# Altium schematic sheet RADIO.SchDoc
size A4
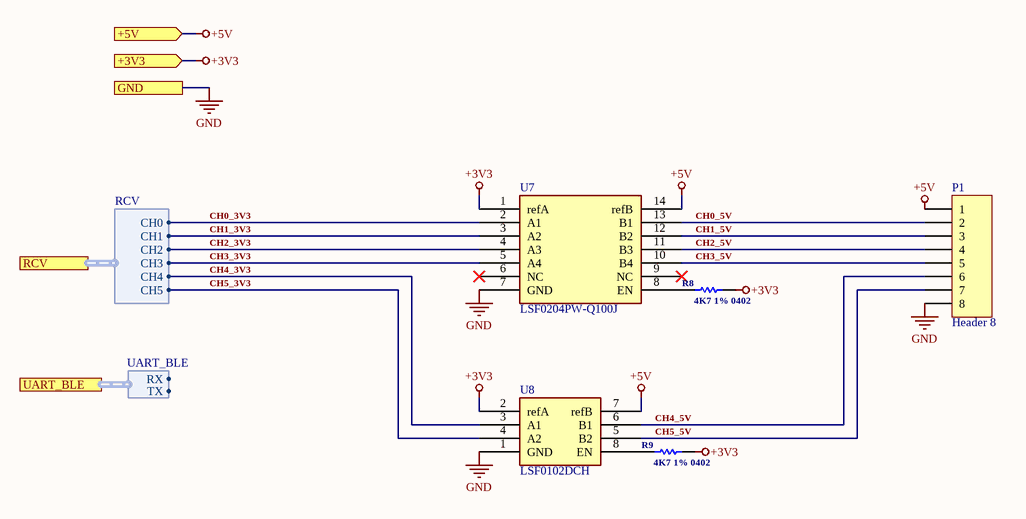
[diagram p0: RADIO.SchDoc]

## Parts
P1  Header 8  [HDR1X8]
R8  4K7 1% 0402  [Resistor_0402]
R9  4K7 1% 0402  [Resistor_0402]
U7  LSF0204PW-Q100J  [TSOP65P640X110-14N]
U8  LSF0102DCH

## Ports
+3V3 (in), +5V (in), GND, RCV (harness RCV), UART_BLE (harness UART_BLE)

## Harnesses
RCV: CH0, CH1, CH2, CH3, CH4, CH5
UART_BLE: RX, TX

## Nets
+3V3: R8.2 R9.2 U7.1(refA) U8.2(refA) ; port +3V3
+5V: P1.1 U7.14(refB) U8.7(refB) ; port +5V
GND: P1.8 U7.7(GND) U8.1(GND) ; port GND
CH0_3V3: U7.2(A1) ; port RCV.CH0
CH0_5V: P1.2 U7.13(B1)
CH1_3V3: U7.3(A2) ; port RCV.CH1
CH1_5V: P1.3 U7.12(B2)
CH2_3V3: U7.4(A3) ; port RCV.CH2
CH2_5V: P1.4 U7.11(B3)
CH3_3V3: U7.5(A4) ; port RCV.CH3
CH3_5V: P1.5 U7.10(B4)
CH4_3V3: U8.3(A1) ; port RCV.CH4
CH4_5V: P1.6 U8.6(B1)
CH5_3V3: U8.4(A2) ; port RCV.CH5
CH5_5V: P1.7 U8.5(B2)
NetR8_1: R8.1 U7.8(EN)
NetR9_1: R9.1 U8.8(EN)

Not connected (* = marked no-connect by the designer): U7 6(NC)* 9(NC)*

## Library data of the parts
P1 = Header 8: Header, 8-Pin; LatestRevisionDate: 17-Jul-2002; LatestRevisionNote: Re-released for DXP Platform.; Publisher: Altium Limited
R8 R9 = AC0402FR-074K7L 4.7K 1% 0402: Thick Film Resistors 1/16W 4.7K ohm 1% AEC-Q200; Manufacturer: Yageo; Resistance: 4.7 kOhms; Power Rating: 62.5 mW (1/16 W); Temperature Coefficient: 100 PPM / C; Voltage Rating: 50 V; Unit Weight: 0.000023 oz; Supplier 1: Digi-Key; Manufacturer Part Number: AC0402FR-074K7L; Stock 1: 3; Pricing 1: 1=0.1, 10=0.021, 100=0.0086, 1000=0.0039, 2500=0.0033, 5000=0.0028 (USD); Product Category: Thick Film Resistors; RoHS: True; Tolerance: 1 %; Case Code - in: 0402; Case Code - mm: 1005; Operating Temperature Range: - 55 C to + 155 C; Series: AC; Brand: Yageo; Height: 0.32 mm; Length: 1 mm; Package / Case: 0402 (1005 metric); Packaging: Reel; Product: Thick Film Resistors SMD; Termination Style: SMD/SMT; Type: Chip Resistor Surface Mount; Width: 0.5 mm; ComponentLink1URL: http://www.mouser.com/ds/2/447/yageodocoutput-1111992.pdf?src-supplier=Mouser; ComponentLink1Description: http://www.mouser.com/ds/2/447/yageodocoutput-1111992.pdf?src-supplier=Mouser; ComponentLink2URL: http://www.yageo.com/documents/recent/PYu-AC_51_RoHS_L_2_revised.pdf?src-supplier=Future+Electronics; ComponentLink2Description: http://www.yageo.com/documents/recent/PYu-AC_51_RoHS_L_2_revised.pdf?src-supplier=Future+Electronics; ComponentLink3URL: http://www.yageo.com/NewPortal/yageodocoutput?fileName=/pdf/R-Chip/PYu-AC_51_RoHS_L_6.pdf&src-supplier=Digi-Key; ComponentLink3Description: http://www.yageo.com/NewPortal/yageodocoutput?fileName=/pdf/R-Chip/PYu-AC_51_RoHS_L_6.pdf&src-supplier=Digi-Key; Supplier Part Number 1: YAG3497CT-ND; Value: 4K7 1% 0402
U7 = LSF0204PW-Q100J: Nivel de voltaje Traductores Bidireccional 1 circuitos 4 canales 120MHz 14-TSSOP; Supplier 1: Digi-Key; Supplier Part Number 1: 1727-LSF0204PW-Q100JCT-ND
U8 = LSF0102DCH: Voltage Level Translator Bidirectional 1 Circuit 2 Channel 100MHz 8-VSSOP; Supplier 1: Digi-Key; Supplier Part Number 1: 1727-LSF0102DCHCT-ND